# Altium schematic sheet BS.SchDoc
size A4
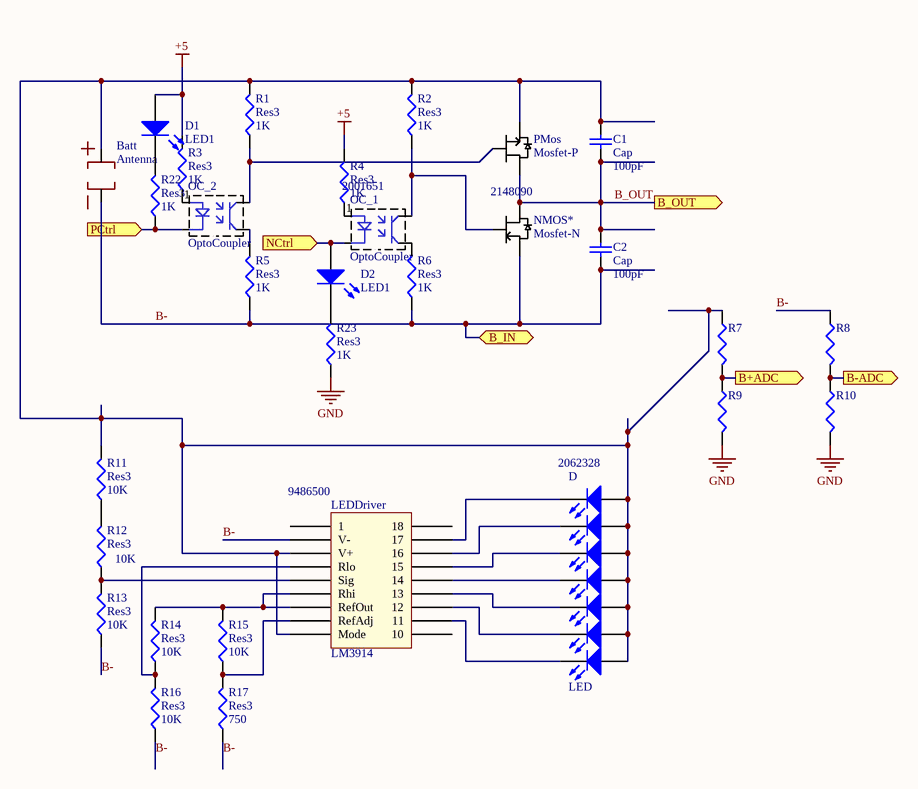
[diagram p0: BS.SchDoc]

## Parts
Batt  Antenna  [18650_PCB_HOLDER]
C1  Cap  value 100pF  [6-0805_L]
C2  Cap  value 100pF  [6-0805_L]
D  LED  Supplier Part Number 1: 2062328  [LED Strip]
D1  LED1  [LED]
D2  LED1  [LED]
LEDDriver  LM3914  Supplier Part Number 1: 9486500  [DIP18]
NMOS*  Mosfet-N  Supplier Part Number 1: 2148090  [MOSFET]
OC_1  OptoCoupler  Supplier Part Number 1: 2001651  [SMDIP4]
OC_2  OptoCoupler  [SMDIP4]
PMos  Mosfet-P  [MOSFET]
R1  Res3  value 1K  [J1-0603]
R2  Res3  value 1K  [J1-0603]
R3  Res3  value 1K  [J1-0603]
R4  Res3  value 1K  [J1-0603]
R5  Res3  value 1K  [J1-0603]
R6  Res3  value 1K  [J1-0603]
R7  Res3  [J1-0603]  (value not drawn)
R8  Res3  [J1-0603]  (value not drawn)
R9  Res3  [J1-0603]  (value not drawn)
R10  Res3  [J1-0603]  (value not drawn)
R11  Res3  value 10K  [J1-0603]
R12  Res3  value 10K  [J1-0603]
R13  Res3  value 10K  [J1-0603]
R14  Res3  value 10K  [J1-0603]
R15  Res3  value 10K  [J1-0603]
R16  Res3  value 10K  [J1-0603]
R17  Res3  value 750  [J1-0603]
R22  Res3  value 1K  [J1-0603]
R23  Res3  value 1K  [J1-0603]

## Ports
B+ADC (out), B-ADC (out), B_IN (bidir), B_OUT (out), NCtrl (in), PCtrl (in)

## Nets
+5: D1.1(A) R3.2 R4.2
GND: R9.1 R10.1 R23.1
B+ADC: R7.2 R9.2 ; port B+ADC
B-: Batt.N C2.1 LEDDriver.2(V-) NMOS*.3(Source) R5.1 R6.1 R8.1 R13.1 R16.1 R17.1 ; port B_IN
B-ADC: R8.2 R10.2 ; port B-ADC
B_OUT: C1.1 C2.2 NMOS*.2(Drain) PMos.3 ; port B_OUT
NCtrl: D2.1(A) OC_1.2 ; port NCtrl
PCtrl: OC_2.2 R22.1 ; port PCtrl
NetBatt_P: Batt.P C1.2 D.1(A) D.3(A) D.5(A) D.7(A) D.9(A) D.11(A) D.13(A) LEDDriver.3(V+) LEDDriver.9(Mode) PMos.2 R1.2 R2.2 R7.1 R11.2
NetD1_2: D1.2(K) R22.2
NetD2_2: D2.2(K) R23.2
NetD_2: D.2(K) LEDDriver.11
NetD_4: D.4(K) LEDDriver.12
NetD_6: D.6(K) LEDDriver.13
NetD_8: D.8(K) LEDDriver.14
NetD_10: D.10(K) LEDDriver.15
NetD_12: D.12(K) LEDDriver.16
NetD_14: D.14(K) LEDDriver.17
NetLEDDriver_4: LEDDriver.4(Rlo) R14.1 R16.2
NetLEDDriver_5: LEDDriver.5(Sig) R12.1 R13.2
NetLEDDriver_6: LEDDriver.6(Rhi) LEDDriver.7(RefOut) R14.2 R15.2
NetLEDDriver_8: LEDDriver.8(RefAdj) R15.1 R17.2
NetNMOS*_1: NMOS*.1(Gate) OC_1.4 R2.1
NetOC_1_1: OC_1.1 R4.1
NetOC_1_3: OC_1.3 R6.2
NetOC_2_1: OC_2.1 R3.1
NetOC_2_3: OC_2.3 R5.2
NetOC_2_4: OC_2.4 PMos.1 R1.1
NetR11_1: R11.1 R12.2

Not connected (* = marked no-connect by the designer): LEDDriver 1 10 18

## Library data of the parts
Batt = BATTERYHOLDER
C1 C2 = Cap: Capacitor; Published: 8-Jun-2000; LatestRevisionDate: 17-Jul-2002; LatestRevisionNote: Re-released for DXP Platform.; PackageReference: RAD-0.3; Publisher: Altium Limited; PackageDescription: Radial Cap, Thru-Hole; 2 Leads; 0.3 in Pin Spacing
D = LEDStrip: Supplier 1: Farnell
D1 D2 = LED1: Typical RED GaAs LED; Published: 8-Jun-2000; LatestRevisionDate: 08-Jul-2005; LatestRevisionNote: Mech Layer 1 removed.; PackageReference: LED-1; Publisher: Altium Limited; PackageDescription: LED; 2 Leads
NMOS* = Mosfet-N: pin to pad: 1>4 2>5 3>1; Supplier 1: Farnell
PMos = Mosfet-P: pin to pad: 1>4 2>1 3>5
R1-R6 R11-R17 R22 R23 = Res3: Resistor; Published: 8-Jun-2000; LatestRevisionDate: 29-May-2009; LatestRevisionNote: IPC-7351 Footprint Added.; PackageReference: J1-0603; Publisher: Altium Limited; PackageDescription: Chip Resistor
R7 R8 = Res3: Resistor; Value: 100K; Published: 8-Jun-2000; LatestRevisionDate: 29-May-2009; LatestRevisionNote: IPC-7351 Footprint Added.; PackageReference: J1-0603; Publisher: Altium Limited; PackageDescription: Chip Resistor
R9 R10 = Res3: Resistor; Value: 1K; Published: 8-Jun-2000; LatestRevisionDate: 29-May-2009; LatestRevisionNote: IPC-7351 Footprint Added.; PackageReference: J1-0603; Publisher: Altium Limited; PackageDescription: Chip Resistor
LEDDriver = LM3914: Supplier 1: Farnell
OC_1 OC_2 = OptoCoupler
  OC_1: Supplier 1: Farnell